# EAGLE schematic LEDDimmerSimple (EAGLE 6.4)
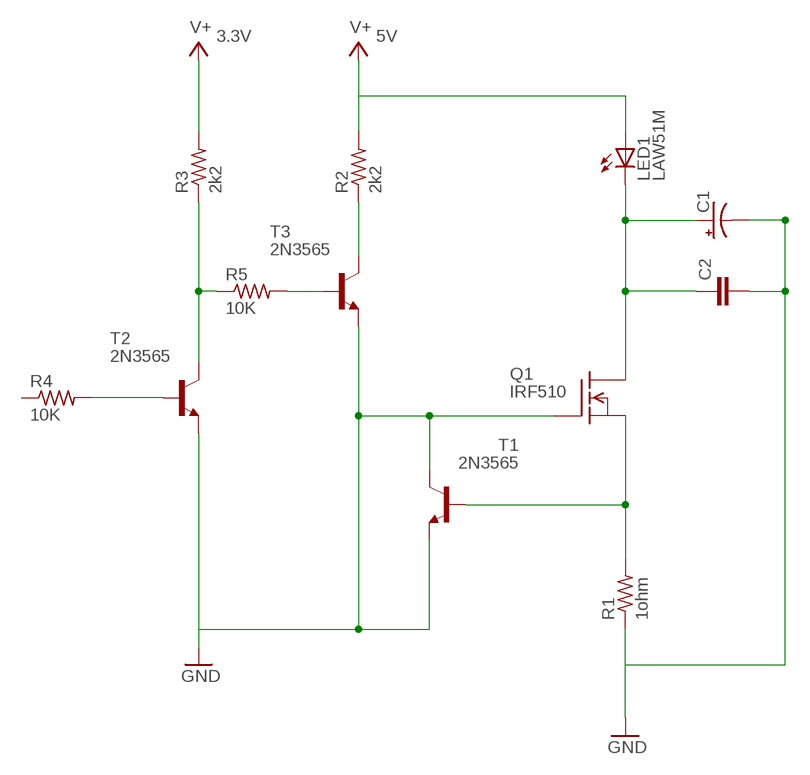
[diagram p0: schematic, sheet 1]

## Parts
C1  CPOL-USE1.8-4  [E1,8-4]
C2  C-EU025-030X050  [C025-030X050]
LED1  LAW51M  [W51]
Q1  IRF510  [TO220]
R1  1ohm  R-US_0613/5V  [P0613V]
R2  2k2  R-US_0207/7  [0207/7]
R3  2k2  R-US_0207/7  [0207/7]
R4  10K  R-US_0207/7  [0207/7]
R5  10K  R-US_0207/7  [0207/7]
T1  2N3565  [TO92]
T2  2N3565  [TO92]
T3  2N3565  [TO92]

## Nets
GND: C1.- C2.2 Q1.1(G) R1.1 T1.1(C) T1.3(E) T2.3(E) T3.3(E)
N$1: R3.1 R5.1 T2.1(C)
N$2: R4.2 T2.2(B)
N$3: R5.2 T3.2(B)
N$4: R2.1 T3.1(C)
N$5: C1.+ C2.1 LED1.C Q1.2(D)
N$6: Q1.3(S) R1.2 T1.2(B)
V+: LED1.A R2.2 R3.2
Unconnected: LED1.TH@1(TH) LED1.TH@2(TH) LED1.TH@3(TH) R4.1

## Library data of the parts
C1 = adafruit:CPOL-US: POLARIZED CAPACITOR, American symbol
C2 = rcl:C-EU: CAPACITOR, European symbol
LED1 = led:*W51M: Golden DRAGON® with Lens Enhanced Thinfilm LED Source: LA_LR_LY_W51M_Pb_free[1].pdf
Q1 = transistor-fet:IRF510: N-Channel Enhancement MOSFET (HEXFET); 100V; 5,6A; 0,54Ohm
R1-R5 = adafruit:R-US_: RESISTOR, American symbol
T1-T3 = transistor:2N3565: NPN TRANSISTOR